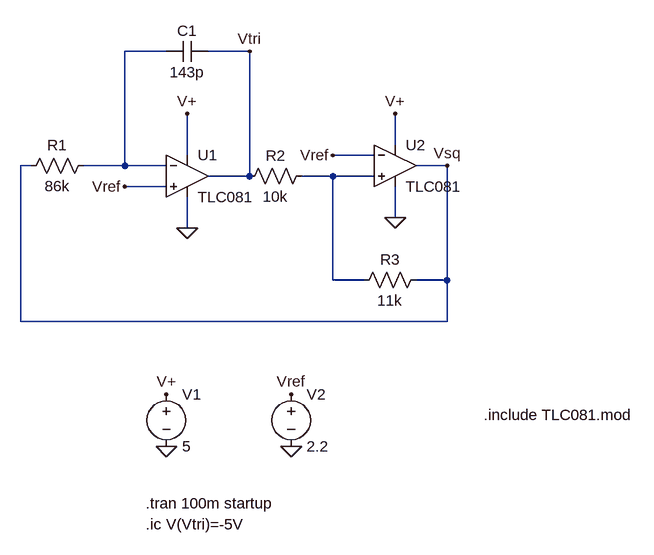
[diagram p0: schematic 310 first edition.asc]
310 first edition.asc, the LTspice schematic file:
Version 4
SHEET 1 880 728
WIRE -16 -112 -80 -112
WIRE 112 -112 48 -112
WIRE 336 32 336 -16
WIRE 16 48 16 -16
WIRE 304 48 240 48
WIRE -224 64 -240 64
WIRE -80 64 -80 -112
WIRE -80 64 -144 64
WIRE -16 64 -80 64
WIRE 416 64 368 64
WIRE 112 80 112 -112
WIRE 112 80 48 80
WIRE 240 80 192 80
WIRE 304 80 240 80
WIRE -16 96 -80 96
WIRE 336 144 336 96
WIRE 16 160 16 112
WIRE 240 240 240 80
WIRE 288 240 240 240
WIRE 416 240 416 64
WIRE 416 240 368 240
WIRE -240 304 -240 64
WIRE 416 304 416 240
WIRE 416 304 -240 304
FLAG 16 -16 V+
FLAG 336 -16 V+
FLAG 416 64 Vsq
FLAG -16 496 0
FLAG -16 416 V+
FLAG 112 -112 Vtri
FLAG 16 160 0
FLAG 336 144 0
FLAG 176 496 0
FLAG 176 416 Vref
FLAG -80 96 Vref
FLAG 240 48 Vref
SYMBOL res -128 48 R90
WINDOW 0 0 56 VBottom 2
WINDOW 3 32 56 VTop 2
SYMATTR InstName R1
SYMATTR Value 86k
SYMBOL cap -16 -96 R270
WINDOW 0 32 32 VTop 2
WINDOW 3 0 32 VBottom 2
SYMATTR InstName C1
SYMATTR Value 143p
SYMBOL res 208 64 R90
WINDOW 0 0 56 VBottom 2
WINDOW 3 32 56 VTop 2
SYMATTR InstName R2
SYMATTR Value 10k
SYMBOL res 384 224 R90
WINDOW 0 0 56 VBottom 2
WINDOW 3 32 56 VTop 2
SYMATTR InstName R3
SYMATTR Value 11k
SYMBOL voltage -16 400 R0
SYMATTR InstName V1
SYMATTR Value 5
SYMBOL voltage 176 400 R0
WINDOW 123 0 0 Left 0
WINDOW 39 0 0 Left 0
SYMATTR InstName V2
SYMATTR Value 2.2
SYMBOL opamp2 16 16 R0
SYMATTR InstName U1
SYMATTR Value TLC081
SYMBOL opamp2 336 0 R0
SYMATTR InstName U2
SYMATTR Value TLC081
TEXT -48 584 Left 2 !.tran 100m startup
TEXT -48 616 Left 2 !.ic V(Vtri)=-5V
TEXT 472 448 Left 2 !.include TLC081.mod

The netlist it stands for:
* 310 first edition.asc
R1 N001 Vsq 86k
C1 N001 Vtri 143p
R2 N002 Vtri 10k
R3 Vsq N002 11k
V1 V+ 0 5
V2 Vref 0 2.2
XU1 Vref N001 V+ 0 Vtri TLC081  ; pins In+ In- V+ V- OUT
XU2 N002 Vref V+ 0 Vsq TLC081  ; pins In+ In- V+ V- OUT
.tran 100m startup
.ic V(Vtri)=-5V
.include TLC081.mod
.backanno
.end